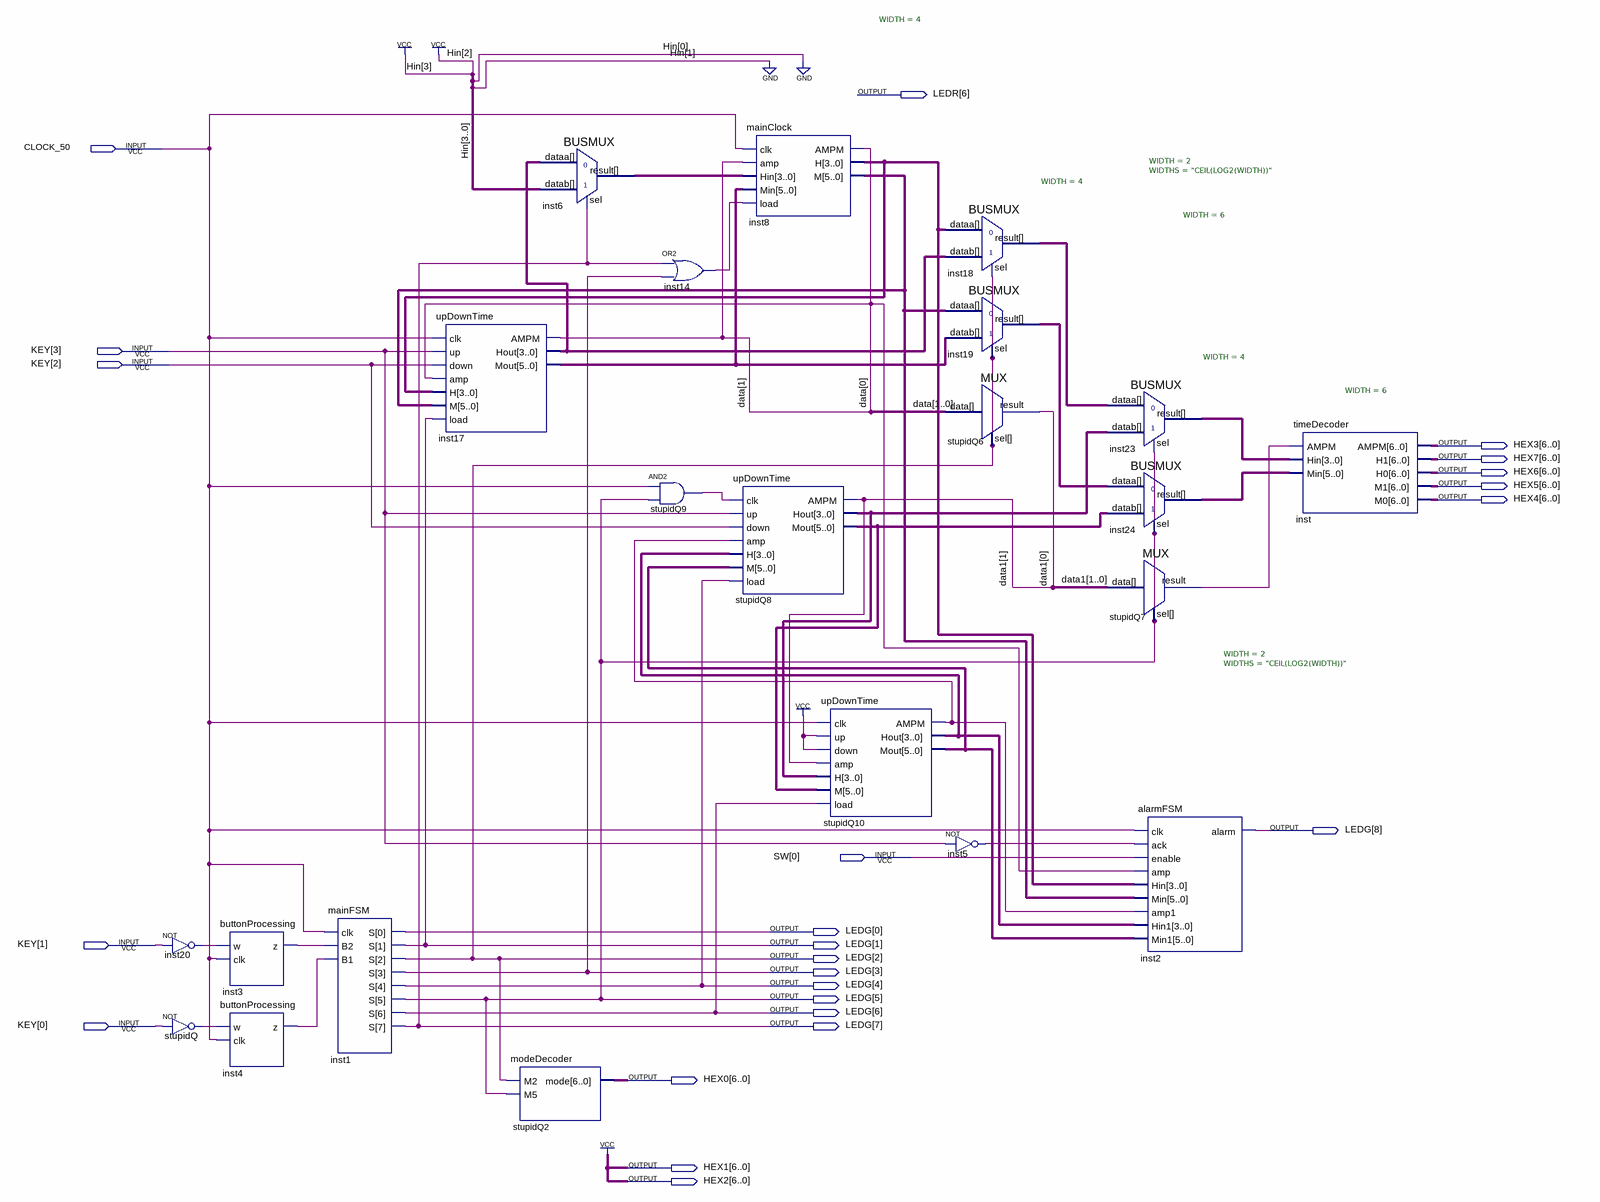
[diagram p0: schematic sheet]
// Quartus schematic proj.bdf as structural Verilog: 22 symbols, 24 pins
module proj (
  input  CLOCK_50,
  input  [3:0] KEY,
  input  [0:0] SW,
  output [6:6] LEDR,
  output [6:0] HEX3,
  output [6:0] HEX7,
  output [6:0] HEX6,
  output [6:0] HEX5,
  output [6:0] HEX4,
  output [8:0] LEDG,
  output [6:0] HEX0,
  output [6:0] HEX1,
  output [6:0] HEX2
);

  wire inst3_z, inst4_z, inst5_out, inst14_out, inst20_out, stupidQ7_result, stupidQ9_out, stupidQ10_ampm,
       stupidQ_out;
  wire [1:0] data, data1;
  wire [3:0] inst6_result, inst8_h, inst17_hout, inst18_result, inst23_result, stupidQ8_hout, stupidQ10_hout;
  wire [5:0] inst8_m, inst17_mout, inst19_result, inst24_result, stupidQ8_mout, stupidQ10_mout;

  not inst20 (inst20_out, KEY[1]);
  not stupidQ (stupidQ_out, KEY[0]);
  buttonProcessing inst3 (.w(inst20_out), .clk(CLOCK_50), .z(inst3_z));
  buttonProcessing inst4 (.w(stupidQ_out), .clk(CLOCK_50), .z(inst4_z));
  mainFSM inst1 (.clk(CLOCK_50), .B2(inst3_z), .B1(inst4_z), .S(LEDG[7:0]));
  upDownTime inst17 (
    .clk(CLOCK_50), .up(KEY[3]), .down(KEY[2]), .amp(data[0]), .H(inst8_h), .M(inst8_m), .load(LEDG[1]),
    .AMPM(data[1]), .Hout(inst17_hout), .Mout(inst17_mout));
  modeDecoder stupidQ2 (.M2(LEDG[2]), .M5(LEDG[5]), .mode(HEX0));
  BUSMUX #(.WIDTH(4)) inst6 (.datab(4'b1100), .sel(LEDG[7]), .dataa(inst17_hout), .result(inst6_result));
  or inst14 (inst14_out, LEDG[7], LEDG[3]);
  and stupidQ9 (stupidQ9_out, CLOCK_50, LEDG[5]);
  mainClock inst8 (
    .clk(CLOCK_50), .amp(data[1]), .Hin(inst6_result), .Min(inst17_mout), .load(inst14_out), .AMPM(data[0]),
    .H(inst8_h), .M(inst8_m));
  upDownTime stupidQ8 (
    .clk(stupidQ9_out), .up(KEY[3]), .down(KEY[2]), .amp(stupidQ10_ampm), .H(stupidQ10_hout),
    .M(stupidQ10_mout), .load(LEDG[4]), .AMPM(data1[1]), .Hout(stupidQ8_hout), .Mout(stupidQ8_mout));
  upDownTime stupidQ10 (
    .clk(CLOCK_50), .up(1'b1), .down(1'b1), .amp(data1[1]), .H(stupidQ8_hout), .M(stupidQ8_mout),
    .load(LEDG[6]), .AMPM(stupidQ10_ampm), .Hout(stupidQ10_hout), .Mout(stupidQ10_mout));
  BUSMUX #(.WIDTH(4)) inst18 (.datab(inst17_hout), .sel(LEDG[2]), .dataa(inst8_h), .result(inst18_result));
  BUSMUX #(.WIDTH(6)) inst19 (.datab(inst17_mout), .sel(LEDG[2]), .dataa(inst8_m), .result(inst19_result));
  MUX #(.WIDTH(2), .WIDTHS("CEIL(LOG2(WIDTH))")) stupidQ6 (.data(data), .sel(LEDG[2]), .result(data1[0]));
  not inst5 (inst5_out, KEY[3]);
  BUSMUX #(.WIDTH(4)) inst23 (.datab(stupidQ8_hout), .sel(LEDG[5]), .dataa(inst18_result), .result(inst23_result));
  BUSMUX #(.WIDTH(6)) inst24 (.datab(stupidQ8_mout), .sel(LEDG[5]), .dataa(inst19_result), .result(inst24_result));
  MUX #(.WIDTH(2), .WIDTHS("CEIL(LOG2(WIDTH))")) stupidQ7 (.data(data1), .sel(LEDG[5]), .result(stupidQ7_result));
  alarmFSM inst2 (
    .clk(CLOCK_50), .ack(inst5_out), .enable(SW[0]), .amp(data[0]), .Hin(inst8_h), .Min(inst8_m),
    .amp1(stupidQ10_ampm), .Hin1(stupidQ10_hout), .Min1(stupidQ10_mout), .alarm(LEDG[8]));
  timeDecoder inst (
    .AMPM({HEX3[6:1], stupidQ7_result, HEX3[0]}), .Hin(inst23_result), .Min(inst24_result), .H1(HEX7),
    .H0(HEX6), .M1(HEX5), .M0(HEX4));

  assign HEX1 = {7{1'b1}};
  assign HEX2 = {7{1'b1}};
endmodule
